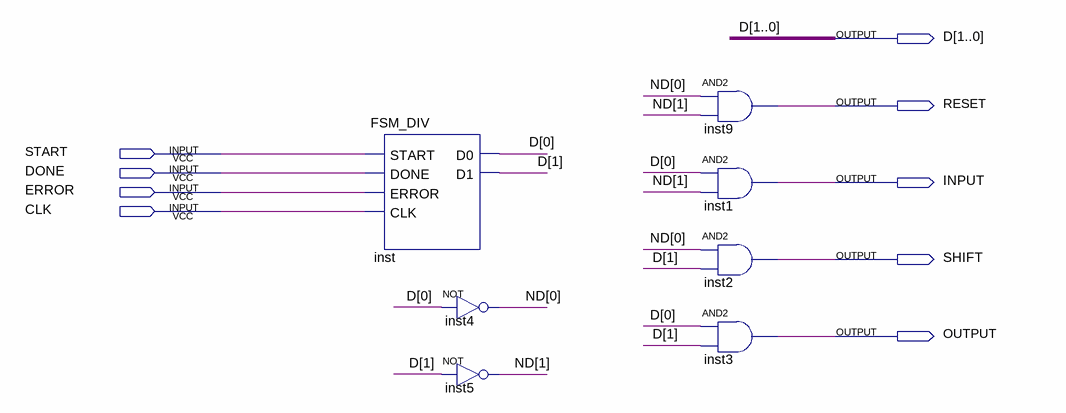
[diagram p0: schematic sheet]
// Quartus schematic DIV_CTRL.bdf as structural Verilog: 7 symbols, 9 pins
module DIV_CTRL (
  input  START,
  input  DONE,
  input  ERROR,
  input  CLK,
  output [1:0] D,
  output RESET,
  output INPUT,
  output SHIFT,
  output OUTPUT
);

  wire [1:0] ND;

  FSM_DIV inst (.START(START), .DONE(DONE), .ERROR(ERROR), .CLK(CLK), .D0(D[0]), .D1(D[1]));
  not inst4 (ND[0], D[0]);
  not inst5 (ND[1], D[1]);
  and inst9 (RESET, ND[0], ND[1]);
  and inst1 (INPUT, D[0], ND[1]);
  and inst2 (SHIFT, ND[0], D[1]);
  and inst3 (OUTPUT, D[0], D[1]);
endmodule
